# EAGLE design simple thermostat 2 (EAGLE 7.4.0)
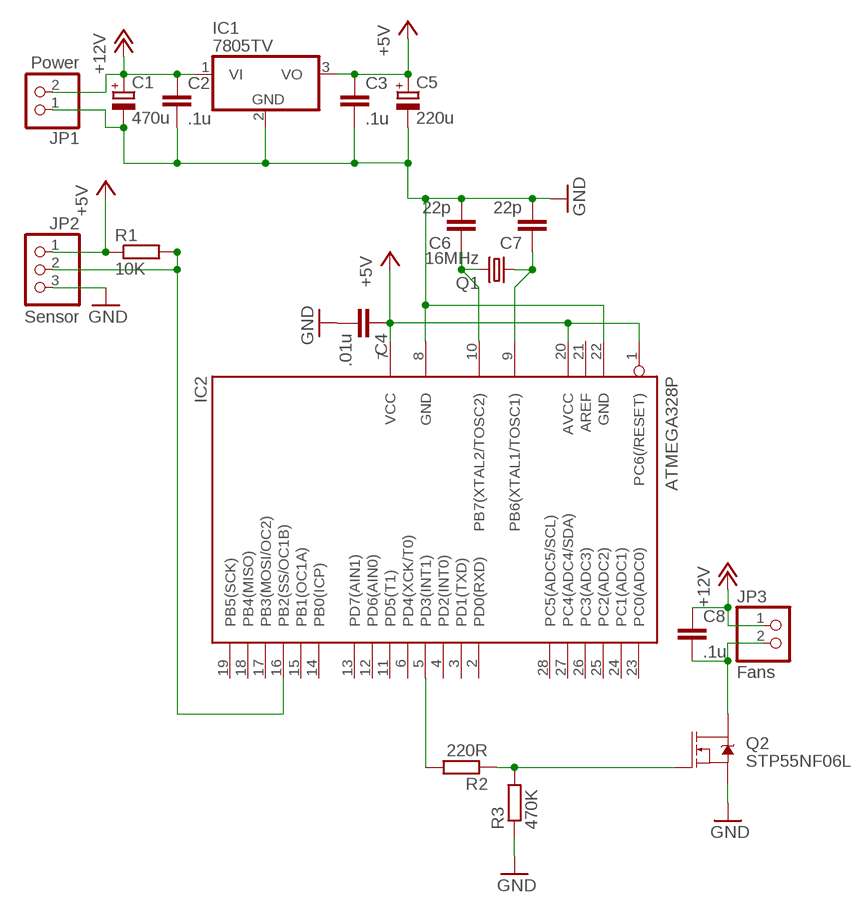
[diagram p0: schematic, sheet 1]

## Parts
C1  470u  CPOL-EUE3.5-10  [E3,5-10]
C2  .1u  C-EU025-024X044  [C025-024X044]
C3  .1u  C-EU025-024X044  [C025-024X044]
C4  .01u  C-EU025-024X044  [C025-024X044]
C5  220u  CPOL-EUE2.5-7  [E2,5-7]
C6  22p  C-EU025-024X044  [C025-024X044]
C7  22p  C-EU025-024X044  [C025-024X044]
C8  .1u  C-EU025-024X044  [C025-024X044]
IC1  7805TV  [TO220V]
IC2  ATMEGA328P  MEGA8-P  [DIL28-3]
JP1  Power  PINHD-1X2  [1X02]
JP2  Sensor  PINHD-1X3  [1X03]
JP3  Fans  PINHD-1X2  [1X02]
Q1  16MHz  CRYSTALHC18U-V  [HC18U-V]
Q2  STP55NF06L  MOSFET-NCH-FQP30N06L  [TO220V]
R1  10K  R-EU_0207/7  [0207/7]
R2  220R  R-EU_0207/7  [0207/7]
R3  470K  R-EU_0207/7  [0207/7]

## Nets
+5V: C3.1 C4.1 C5.+ IC1.3(VO) IC2.1(PC6(/RESET)) IC2.7(VCC) IC2.20(AVCC) JP2.1 R1.1
+12V: C1.+ C2.1 C8.1 IC1.1(VI) JP1.2 JP3.1
GND: C1.- C2.2 C3.2 C4.2 C5.- C6.2 C7.2 IC1.2(GND) IC2.8(GND) IC2.22(GND) JP1.1 JP2.3 Q2.3(S) R3.1
N$1: IC2.5(PD3(INT1)) R2.2
N$2: Q2.1(G) R2.1 R3.2
N$3: C8.2 JP3.2 Q2.2(D)
N$19: IC2.16(PB2(SS/OC1B)) JP2.2 R1.2
N$45: C7.1 IC2.9(PB6(XTAL1/TOSC1)) Q1.1
N$47: C6.1 IC2.10(PB7(XTAL2/TOSC2)) Q1.2
Unconnected: IC2.2(PD0(RXD)) IC2.3(PD1(TXD)) IC2.4(PD2(INT0)) IC2.6(PD4(XCK/T0)) IC2.11(PD5(T1)) IC2.12(PD6(AIN0)) IC2.13(PD7(AIN1)) IC2.14(PB0(ICP)) IC2.15(PB1(OC1A)) IC2.17(PB3(MOSI/OC2)) IC2.18(PB4(MISO)) IC2.19(PB5(SCK)) IC2.21(AREF) IC2.23(PC0(ADC0)) IC2.24(PC1(ADC1)) IC2.25(PC2(ADC2)) IC2.26(PC3(ADC3)) IC2.27(PC4(ADC4/SDA)) IC2.28(PC5(ADC5/SCL))

## Library data of the parts
C1 C5 = resistor:CPOL-EU: POLARIZED CAPACITOR, European symbol
C2-C4 C6-C8 = resistor:C-EU: CAPACITOR, European symbol
IC1 = linear:78*: Positive VOLTAGE REGULATOR Source: http://cache.national.com/ds/LM/LM78L05.pdf http://www.fairchildsemi.com/ds/LM/LM7805.pdf
IC2 = atmel:MEGA8-P: MICROCONTROLLER 8 Kbytes FLASH, 1 kbytes SRAM, 512 bytes EEPROM, USART, 4-channel 10 bit ADC, 2-channel 8 bit ADC Pin compatible with Atmega48, ATMega88, ATMega168 Source: avr.lbr; OC_FARNELL: unknown; OC_NEWARK: unknown
JP1 JP3 = pinhead:PINHD-1X2: PIN HEADER
JP2 = pinhead:PINHD-1X3: PIN HEADER
Q1 = crystal:CRYSTAL: CRYSTAL; OC_FARNELL: unknown; OC_NEWARK: unknown
Q2 = SparkFun-DiscreteSemi:MOSFET-NCH: N-channel MOSFETs Voltage controlled devices that allow control of high current outputs. SparkFun Products: SparkFun OpenScale <https://www.sparkfun.com/products/13261> SparkFun Digital Sandbox <https://www.sparkfun.com/products/12651> SparkFun Monster Moto Shield <https://www.sparkfun.com/products/10182> SparkFun MOSFET Power Controller <https://www.sparkfun.com/products/11214>; PROD_ID: TRANS-10060; VALUE: 60V/32A/35mΩ
R1-R3 = resistor:R-EU_: RESISTOR, European symbol

## Board
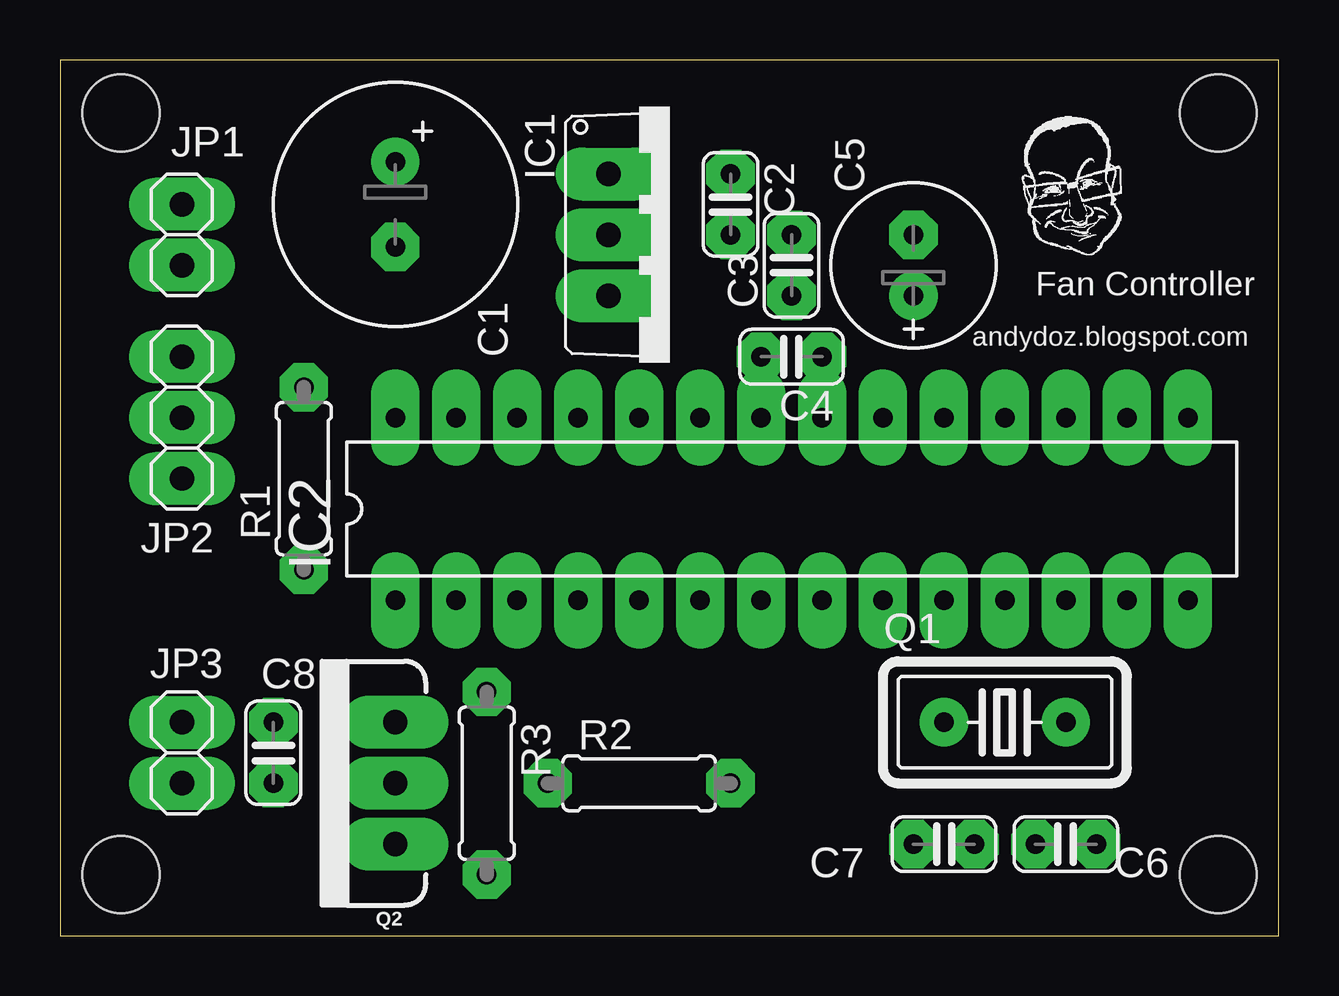
[diagram p1: board, top side]
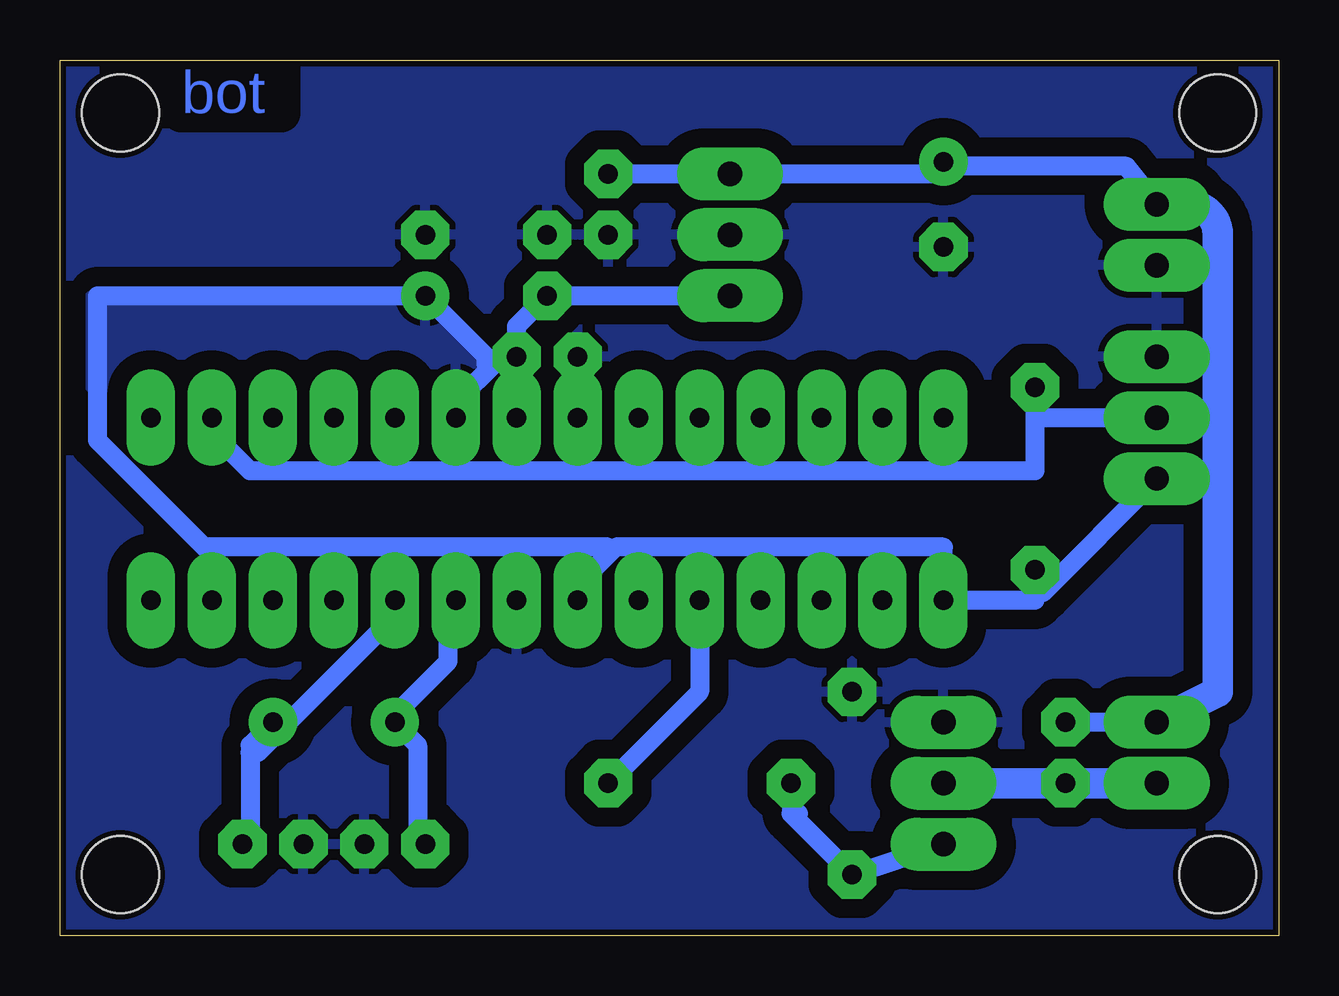
[diagram p2: board, bottom side, seen from below]

Size 50.78 x 36.5 mm. Coordinates in mm from the lower left corner, seen from the top.
Outline: 0,0 50.78,0 50.78,36.5 0,36.5 0,0
Copper layers (1*16): Top 0.035mm / dielectric 1.5mm / Bottom 0.035mm
Design rules "fat and wide": minimum track width 0.8mm, minimum drill 0.8mm, track to track 0.8mm, track to pad 0.8mm, pad to pad 0.45mm, via to via 0.8mm, smd to smd 8mil, copper to edge 10mil, drill to drill 8mil, minimum pad ring 0.6mm, minimum via ring 0.6mm, stop-mask expansion 0mil, vias tented up to drill 0mil, thermal gap 10mil
Holes 3.2 mm at 48.26,34.29 48.26,2.54 2.54,2.54 2.54,34.29

### Footprints (pad centres in the part's own frame; a part is rotated, then mirrored left to right if it is on the bottom)
E3,5-10 = drill 0.813 pad 1.6: + -1.778,0 | drill 0.813 pad 1.6 octagon: - 1.778,0
C025-024X044 = drill 0.813 octagon: 1 -1.27,0; 2 1.27,0
E2,5-7 = drill 0.813 pad 1.6: + -1.27,0 | drill 0.813 pad 1.6 octagon: - 1.27,0
TO220V = drill 1.016 long: 1 -2.54,-2.54; 2 0,-2.54; 3 2.54,-2.54
DIL28-3 = drill 0.813 long: 1 -16.51,-3.81; 2 -13.97,-3.81; 3 -11.43,-3.81; 4 -8.89,-3.81; 5 -6.35,-3.81; 6 -3.81,-3.81; 7 -1.27,-3.81; 8 1.27,-3.81; 9 3.81,-3.81; 10 6.35,-3.81; 11 8.89,-3.81; 12 11.43,-3.81; 13 13.97,-3.81; 14 16.51,-3.81; 15 16.51,3.81; 16 13.97,3.81; 17 11.43,3.81; 18 8.89,3.81; 19 6.35,3.81; 20 3.81,3.81; 21 1.27,3.81; 22 -1.27,3.81; 23 -3.81,3.81; 24 -6.35,3.81; 25 -8.89,3.81; 26 -11.43,3.81; 27 -13.97,3.81; 28 -16.51,3.81
1X02 = drill 1.016 long: 1 -1.27,0; 2 1.27,0
1X03 = drill 1.016 long: 1 -2.54,0; 2 0,0; 3 2.54,0
HC18U-V = drill 0.813: 1 -2.54,0; 2 2.54,0
TO220V' = drill 1.016 long: 1 -2.54,0; 2 0,0; 3 2.54,0
0207/7 = drill 0.813 octagon: 1 -3.81,0; 2 3.81,0

### Placement (x,y rotation side)
C1  13.97,30.48 270 top
C2  27.94,30.48 270 top
C3  30.48,27.94 90 top
C4  30.48,24.13 180 top
C5  35.56,27.94 90 top
C6  41.91,3.81 180 top
C7  36.83,3.81 0 top
C8  8.89,7.62 270 top
IC1  25.4,29.21 270 top
IC2  30.48,17.78 0 top
JP1  5.08,29.21 90 top
JP2  5.08,21.59 90 top
JP3  5.08,7.62 270 top
Q1  39.37,8.89 0 top
Q2  STP55NF06L  [TO220V']  13.97,6.35 90 top
R1  10.16,19.05 90 top
R2  24.13,6.35 0 top
R3  17.78,6.35 270 top

### Tracks (layer width: path | path; a pad name or v marks a point on that pad's centre or on a via)
+5V
  Bottom 0.8: IC2.20 33.97,21.91 33.97,22.54 32.86,23.65 | 32.86,23.65 32.07,24.45 C4.1 31.75,25.4 C3.1 IC1.3 | 32.86,23.65 33.02,23.81 33.02,24.13 C5.+ 49.21,26.67 49.21,20.64 44.77,16.19 27.94,16.19 27.78,16.03 | IC2.7 28.89,14.29 28.89,14.92 27.78,16.03 | 27.78,16.03 27.62,16.19 13.97,16.19 IC2.1 10.16,13.97 R1.1 9.84,14.29 JP2.1
  pour Bottom: 34.29,22.86 33.02,24.13 35.56,26.67 49.53,26.67 49.53,22.86
+12V
  Bottom 0.8: C2.1 IC1.1 13.97,31.75 C1.+ 13.97,32.07 6.35,32.07 JP1.2 | C8.1 JP3.1 5.08,9.21
  Bottom 1.27: JP1.2 3.81,30.48 arc90 2.54,29.21 2.54,10.16 JP3.1
GND
  pour Bottom: 0,36.83 50.8,36.83 50.8,0 0,0
N$1
  Bottom 0.8: R2.2 24.13,10.16 IC2.5
N$2
  Bottom 0.8: 20.16,4.92 20.32,5.08 R2.1 | 20.16,4.92 R3.2 | 20,5.08 20.16,4.92
  Bottom 0.813: Q2.1 R3.2
N$3
  Bottom 1.27: Q2.2 C8.2 JP3.2
N$19
  Bottom 0.8: IC2.16 44.13,21.27 44.13,20.64 42.86,19.37 10.16,19.37 10.16,21.59 | R1.2 10.16,21.59 | 10.16,21.59 JP2.2
N$45
  Bottom 0.8: C7.1 35.88,4.13 35.88,7.94 Q1.1 36.83,9.21 34.61,11.43 34.61,13.65 IC2.9
N$47
  Bottom 0.8: C6.1 42.86,4.13 42.86,7.62 | 42.86,7.62 42.86,7.94 Q1.2 | IC2.10 37.15,13.65 37.15,13.02 42.55,7.62 42.86,7.62

### Text on the board
Bottom: bot
tPlace: Fan Controller | andydoz.blogspot.com